# EAGLE schematic Slutsteg (EAGLE 9.6.2)

## Sheet 1 of 6: Connectors
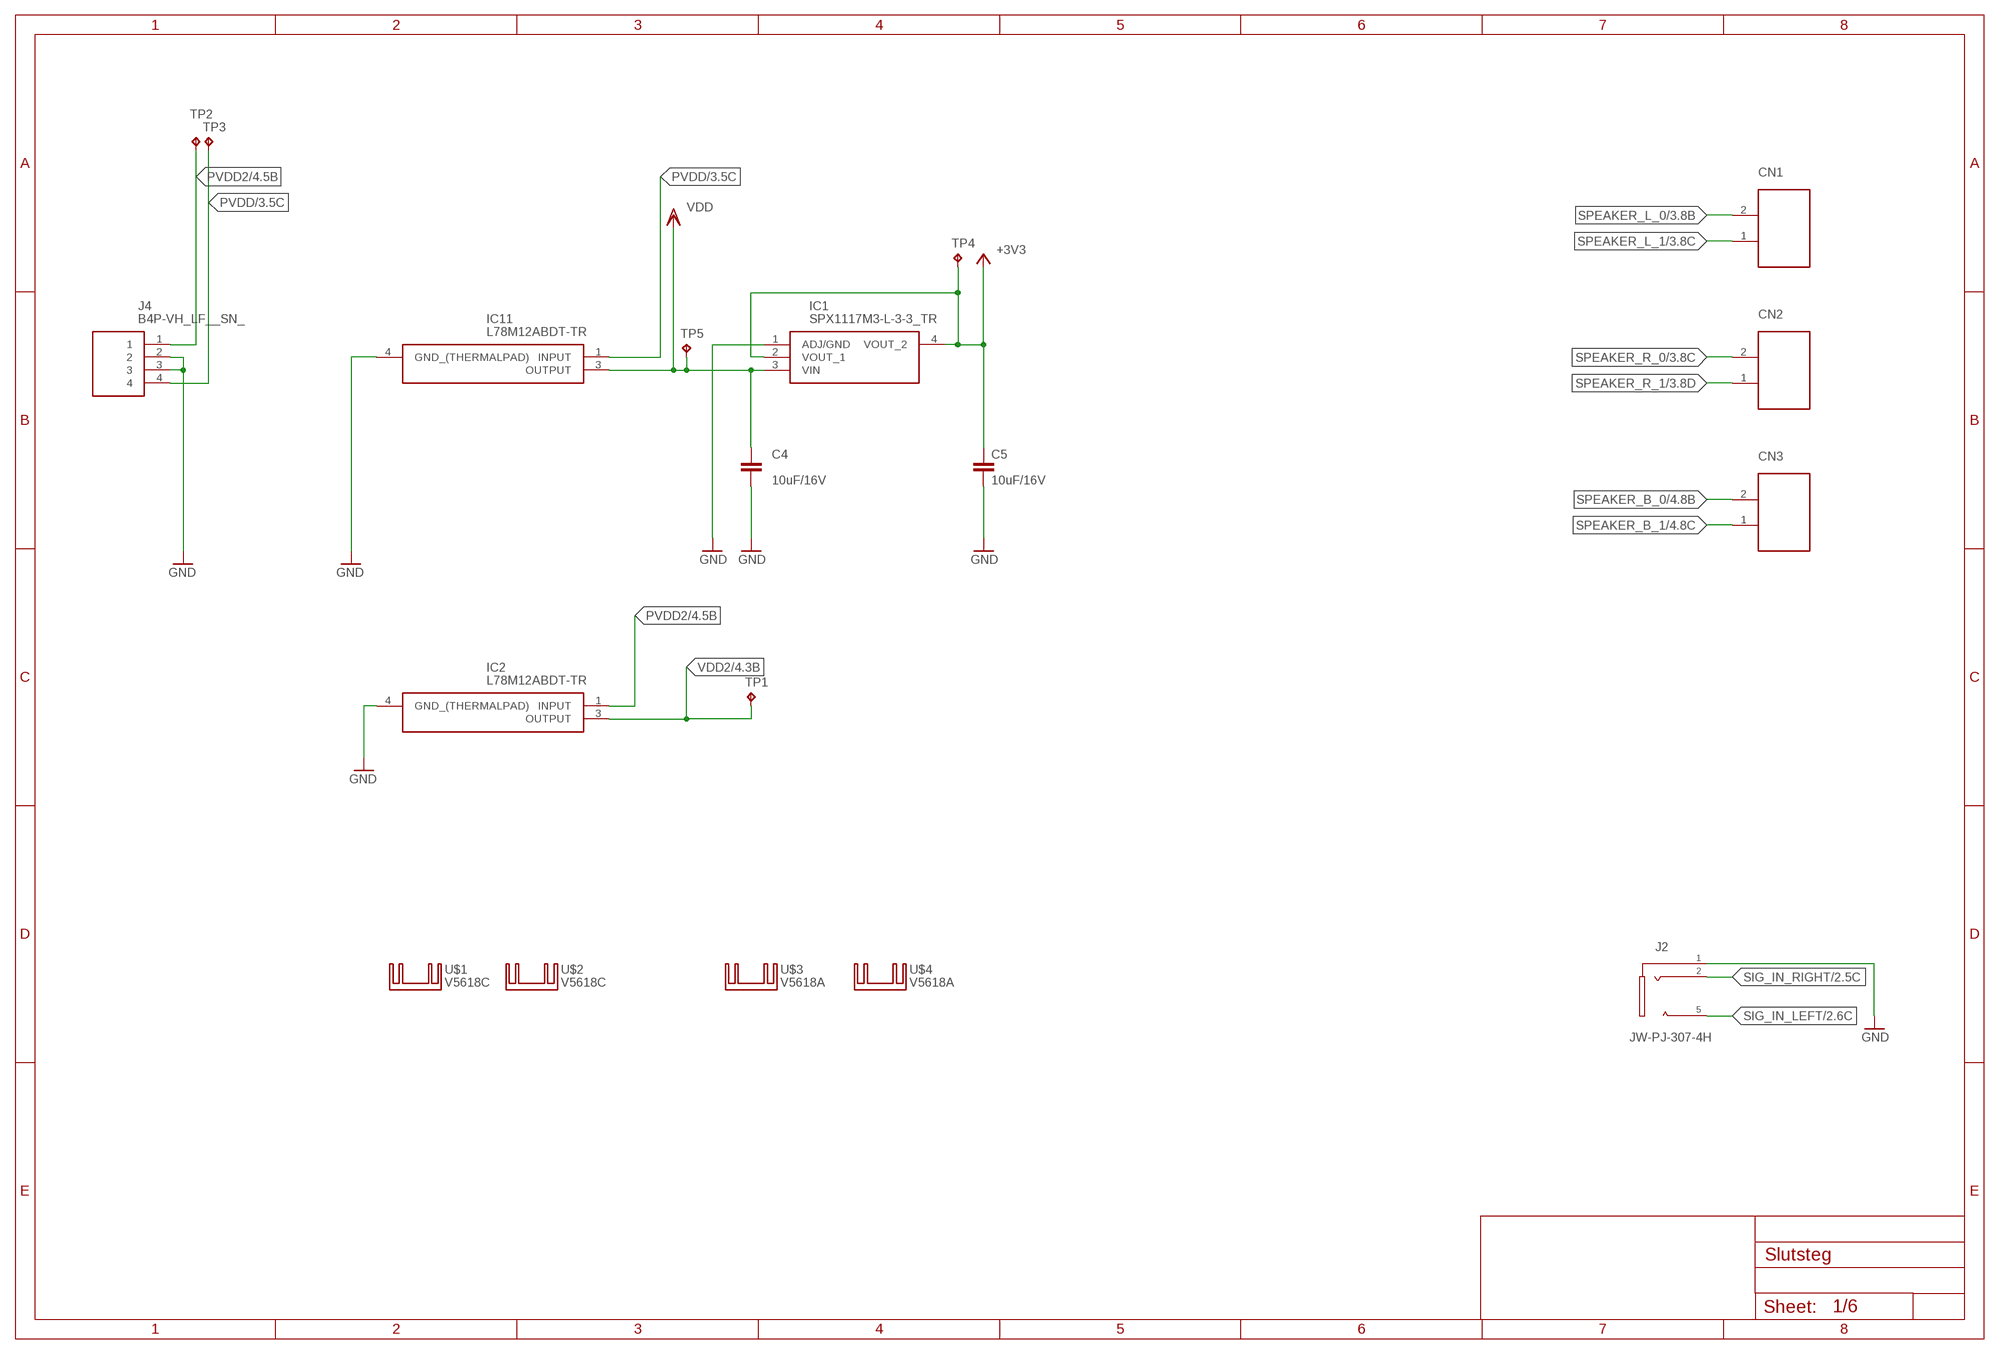
[diagram p0: schematic, sheet 1]

### Parts
C4  10uF/16V  C-EUC0805  [C0805]
C5  10uF/16V  C-EUC0805  [C0805]
CN1  OSTYK33102030-2  [OSTYK33108030-2]
CN2  OSTYK33102030-2  [OSTYK33108030-2]
CN3  OSTYK33102030-2  [OSTYK33108030-2]
IC1  SPX1117M3-L-3-3_TR  [SOT230P700X180-4N]
IC2  L78M12ABDT-TR  [TO228P972X240-3N]
IC11  L78M12ABDT-TR  [TO228P972X240-3N]
J2  JW-PJ-307-4H  [JW-PJ-307-4H]
J4  B4P-VH_LF__SN_  [SHDR4W114P0X396_1X4_1578X850X9]
TP1  TPB2,54  [B2,54]
TP2  TPB1,27  [B1,27]
TP3  TPB1,27  [B1,27]
TP4  TPB1,27  [B1,27]
TP5  TPB1,27  [B1,27]
U$1  V5618C  [V5618C]
U$2  V5618C  [V5618C]
U$3  V5618A  [V5618A]
U$4  V5618A  [V5618A]

### Nets
+3V3: C5.1 IC1.2(VOUT_1) IC1.4(VOUT_2) TP4.TP ; also sheet 2,3
GND: C4.2 C5.2 IC1.1(ADJ/GND) IC2.4(GND_(THERMALPAD)) IC11.4(GND_(THERMALPAD)) J2.1 J4.2 J4.3 ; also sheet 2,3,4,5,6
PVDD: IC11.1(INPUT) J4.4 TP3.TP ; also sheet 3
PVDD2: IC2.1(INPUT) J4.1 TP2.TP ; also sheet 4
SIG_IN_LEFT: J2.5 ; also sheet 2,5
SIG_IN_RIGHT: J2.2 ; also sheet 2,5
SPEAKER_B_0: CN3.2 ; also sheet 4
SPEAKER_B_1: CN3.1 ; also sheet 4
SPEAKER_L_0: CN1.2 ; also sheet 3
SPEAKER_L_1: CN1.1 ; also sheet 3
SPEAKER_R_0: CN2.2 ; also sheet 3
SPEAKER_R_1: CN2.1 ; also sheet 3
VDD: C4.1 IC1.3(VIN) IC11.3(OUTPUT) TP5.TP ; also sheet 2,3,5,6
VDD2: IC2.3(OUTPUT) TP1.TP ; also sheet 4

## Sheet 2 of 6
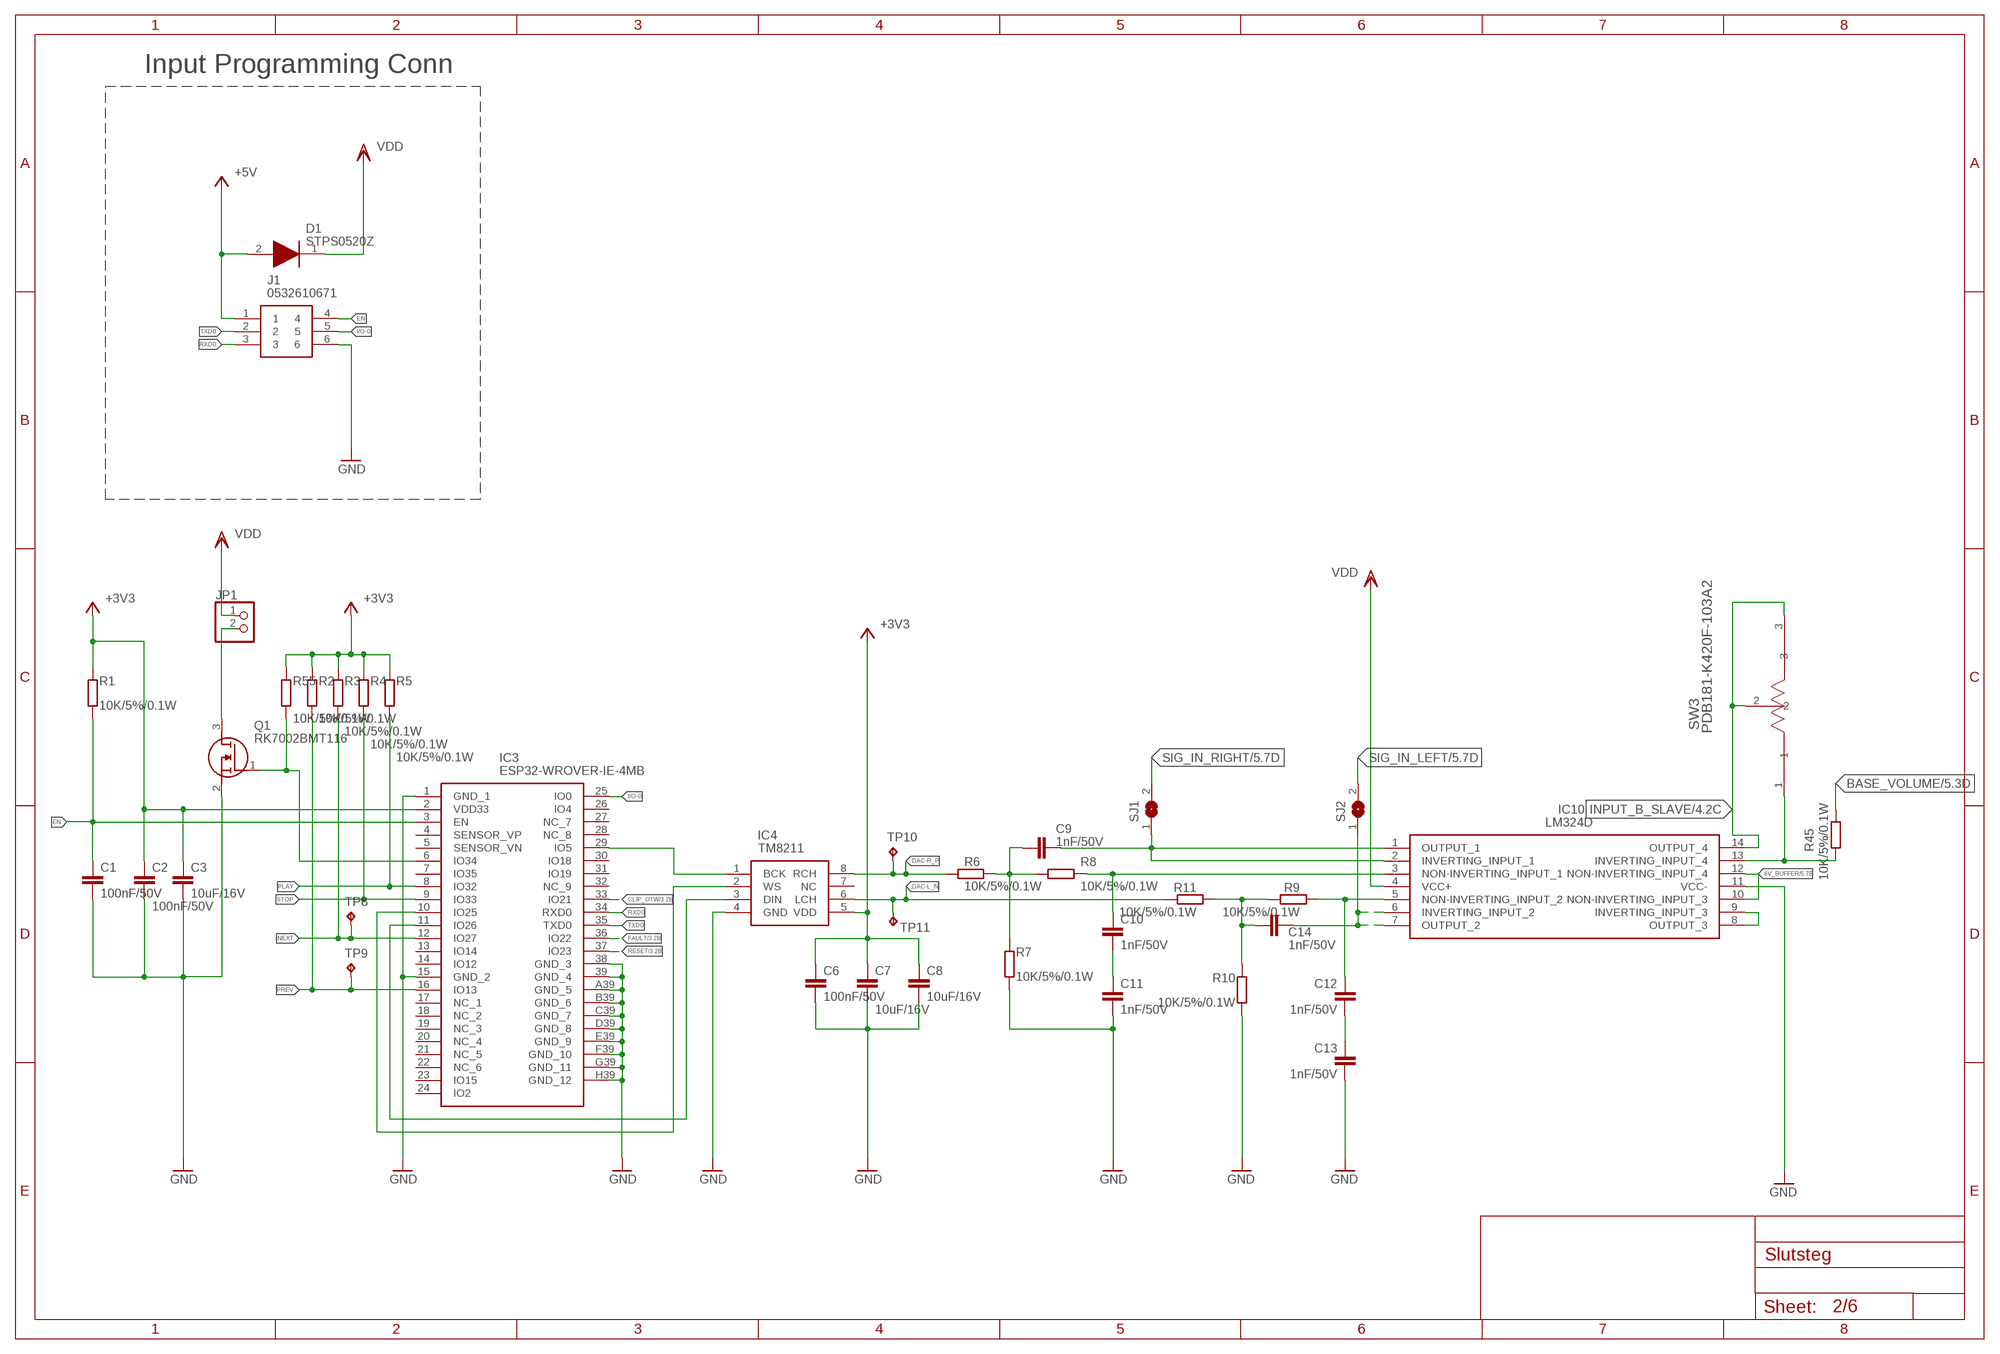
[diagram p1: schematic, sheet 2]

### Parts
C1  100nF/50V  C-EUC0603  [C0603]
C2  100nF/50V  C-EUC0603  [C0603]
C3  10uF/16V  C-EUC0805  [C0805]
C6  100nF/50V  C-EUC0603  [C0603]
C7  10uF/16V  C-EUC0805  [C0805]
C8  10uF/16V  C-EUC0805  [C0805]
C9  1nF/50V  C-EUC0603  [C0603]
C10  1nF/50V  C-EUC0603  [C0603]
C11  1nF/50V  C-EUC0603  [C0603]
C12  1nF/50V  C-EUC0603  [C0603]
C13  1nF/50V  C-EUC0603  [C0603]
C14  1nF/50V  C-EUC0603  [C0603]
D1  STPS0520Z  [SOD3816X145N]
IC3  ESP32-WROVER-IE-4MB  ESP32-WROVER-IE__16MB_  [ESP32WROVERE8MB]
IC4  TM8211  [SOIC127P600X196-8N]
IC10  LM324D  [SOIC127P600X175-14N]
J1  0532610671  [0532610671]
JP1  PINHD-1X2  [1X02]
Q1  RK7002BMT116  [BSS64AHZGT116]
R1  10K/5%/0.1W  R-EU_R0603  [R0603]
R2  10K/5%/0.1W  R-EU_R0603  [R0603]
R3  10K/5%/0.1W  R-EU_R0603  [R0603]
R4  10K/5%/0.1W  R-EU_R0603  [R0603]
R5  10K/5%/0.1W  R-EU_R0603  [R0603]
R6  10K/5%/0.1W  R-EU_R0603  [R0603]
R7  10K/5%/0.1W  R-EU_R0603  [R0603]
R8  10K/5%/0.1W  R-EU_R0603  [R0603]
R9  10K/5%/0.1W  R-EU_R0603  [R0603]
R10  10K/5%/0.1W  R-EU_R0603  [R0603]
R11  10K/5%/0.1W  R-EU_R0603  [R0603]
R45  10K/5%/0.1W  R-EU_R0603  [R0603]
R55  10K/5%/0.1W  R-EU_R0603  [R0603]
SJ1  SJ  [SJ]
SJ2  SJ  [SJ]
SW3  PDB181-K420F-103A2  [SW_420F-103A2_BRN]
TP8  TPB1,27  [B1,27]
TP9  TPB1,27  [B1,27]
TP10  TPB1,27  [B1,27]
TP11  TPB1,27  [B1,27]

### Nets
6V_BUFFER: IC10.10(NON-INVERTING_INPUT_3) IC10.12(NON-INVERTING_INPUT_4) ; also sheet 5
+3V3: C2.1 C3.1 C6.1 C7.1 C8.1 IC3.2(VDD33) IC4.5(VDD) R1.1 R2.1 R3.1 R4.1 R5.1 R55.1 ; also sheet 1,3
+5V: D1.2(A) J1.1
BASE_VOLUME: R45.1 ; also sheet 5
CLIP_OTW: IC3.33(IO21) ; also sheet 3,4
DAC-L_N [DAC-Diff]: IC4.6(LCH) R11.1 TP11.TP
DAC-R_P [DAC-Diff]: IC4.8(RCH) R6.2 TP10.TP
EN: C1.1 IC3.3(EN) J1.4 R1.2
FAULT: IC3.36(IO22) ; also sheet 3,4
GND: C1.2 C2.2 C3.2 C6.2 C7.2 C8.2 C11.2 C13.2 IC3.1(GND_1) IC3.15(GND_2) IC3.38(GND_3) IC3.39(GND_4) IC3.A39(GND_5) IC3.B39(GND_6) IC3.C39(GND_7) IC3.D39(GND_8) IC3.E39(GND_9) IC3.F39(GND_10) IC3.G39(GND_11) IC3.H39(GND_12) IC4.4(GND) IC10.11(VCC-) J1.6 Q1.2(S) R7.2 R10.2 ; also sheet 1,3,4,5,6
GSDJT: C9.1 IC10.1(OUTPUT_1) IC10.2(INVERTING_INPUT_1) SJ1.1
I/O-0: IC3.25(IO0) J1.5
INPUT_B_SLAVE: IC10.14(OUTPUT_4) SW3.2 SW3.3 ; also sheet 4,6
N$4: IC10.13(INVERTING_INPUT_4) R45.2 SW3.1
N$5: IC10.8(OUTPUT_3) IC10.9(INVERTING_INPUT_3)
N$13: IC3.6(IO34) Q1.1(G) R55.2
N$14: JP1.2 Q1.3(D)
N$76: IC3.11(IO26) IC4.3(DIN)
N$77: IC3.29(IO5) IC4.1(BCK)
N$78: IC3.10(IO25) IC4.2(WS)
N$79: C10.1 IC10.3(NON-INVERTING_INPUT_1) R8.1
N$80: C10.2 C11.1
N$81: C12.1 IC10.5(NON-INVERTING_INPUT_2) R9.2
N$82: C12.2 C13.1
N$83: C14.2 R9.1 R10.1 R11.2
N$84: C9.2 R6.1 R7.1 R8.2
NEXT: IC3.12(IO27) R3.2 TP8.TP
PLAY: IC3.8(IO32) R5.2
PREV: IC3.16(IO13) R2.2 TP9.TP
RESET: IC3.37(IO23) ; also sheet 3,4
RXD0: IC3.34(RXD0) J1.3
SIG_IN_LEFT: SJ2.2 ; also sheet 1,5
SIG_IN_RIGHT: SJ1.2 ; also sheet 1,5
STOP: IC3.9(IO33) R4.2
TGHJESYRJK: C14.1 IC10.6(INVERTING_INPUT_2) IC10.7(OUTPUT_2) SJ2.1
TXD0: IC3.35(TXD0) J1.2
VDD: D1.1(K) IC10.4(VCC+) JP1.1 ; also sheet 1,3,5,6
Unconnected: IC3.4(SENSOR_VP) IC3.5(SENSOR_VN) IC3.7(IO35) IC3.13(IO14) IC3.14(IO12) IC3.17(NC_1) IC3.18(NC_2) IC3.19(NC_3) IC3.20(NC_4) IC3.21(NC_5) IC3.22(NC_6) IC3.23(IO15) IC3.24(IO2) IC3.26(IO4) IC3.27(NC_7) IC3.28(NC_8) IC3.30(IO18) IC3.31(IO19) IC3.32(NC_9) IC4.7(NC)

### Notes on the sheet
- Input Programming Conn

## Sheet 3 of 6: TPA3244
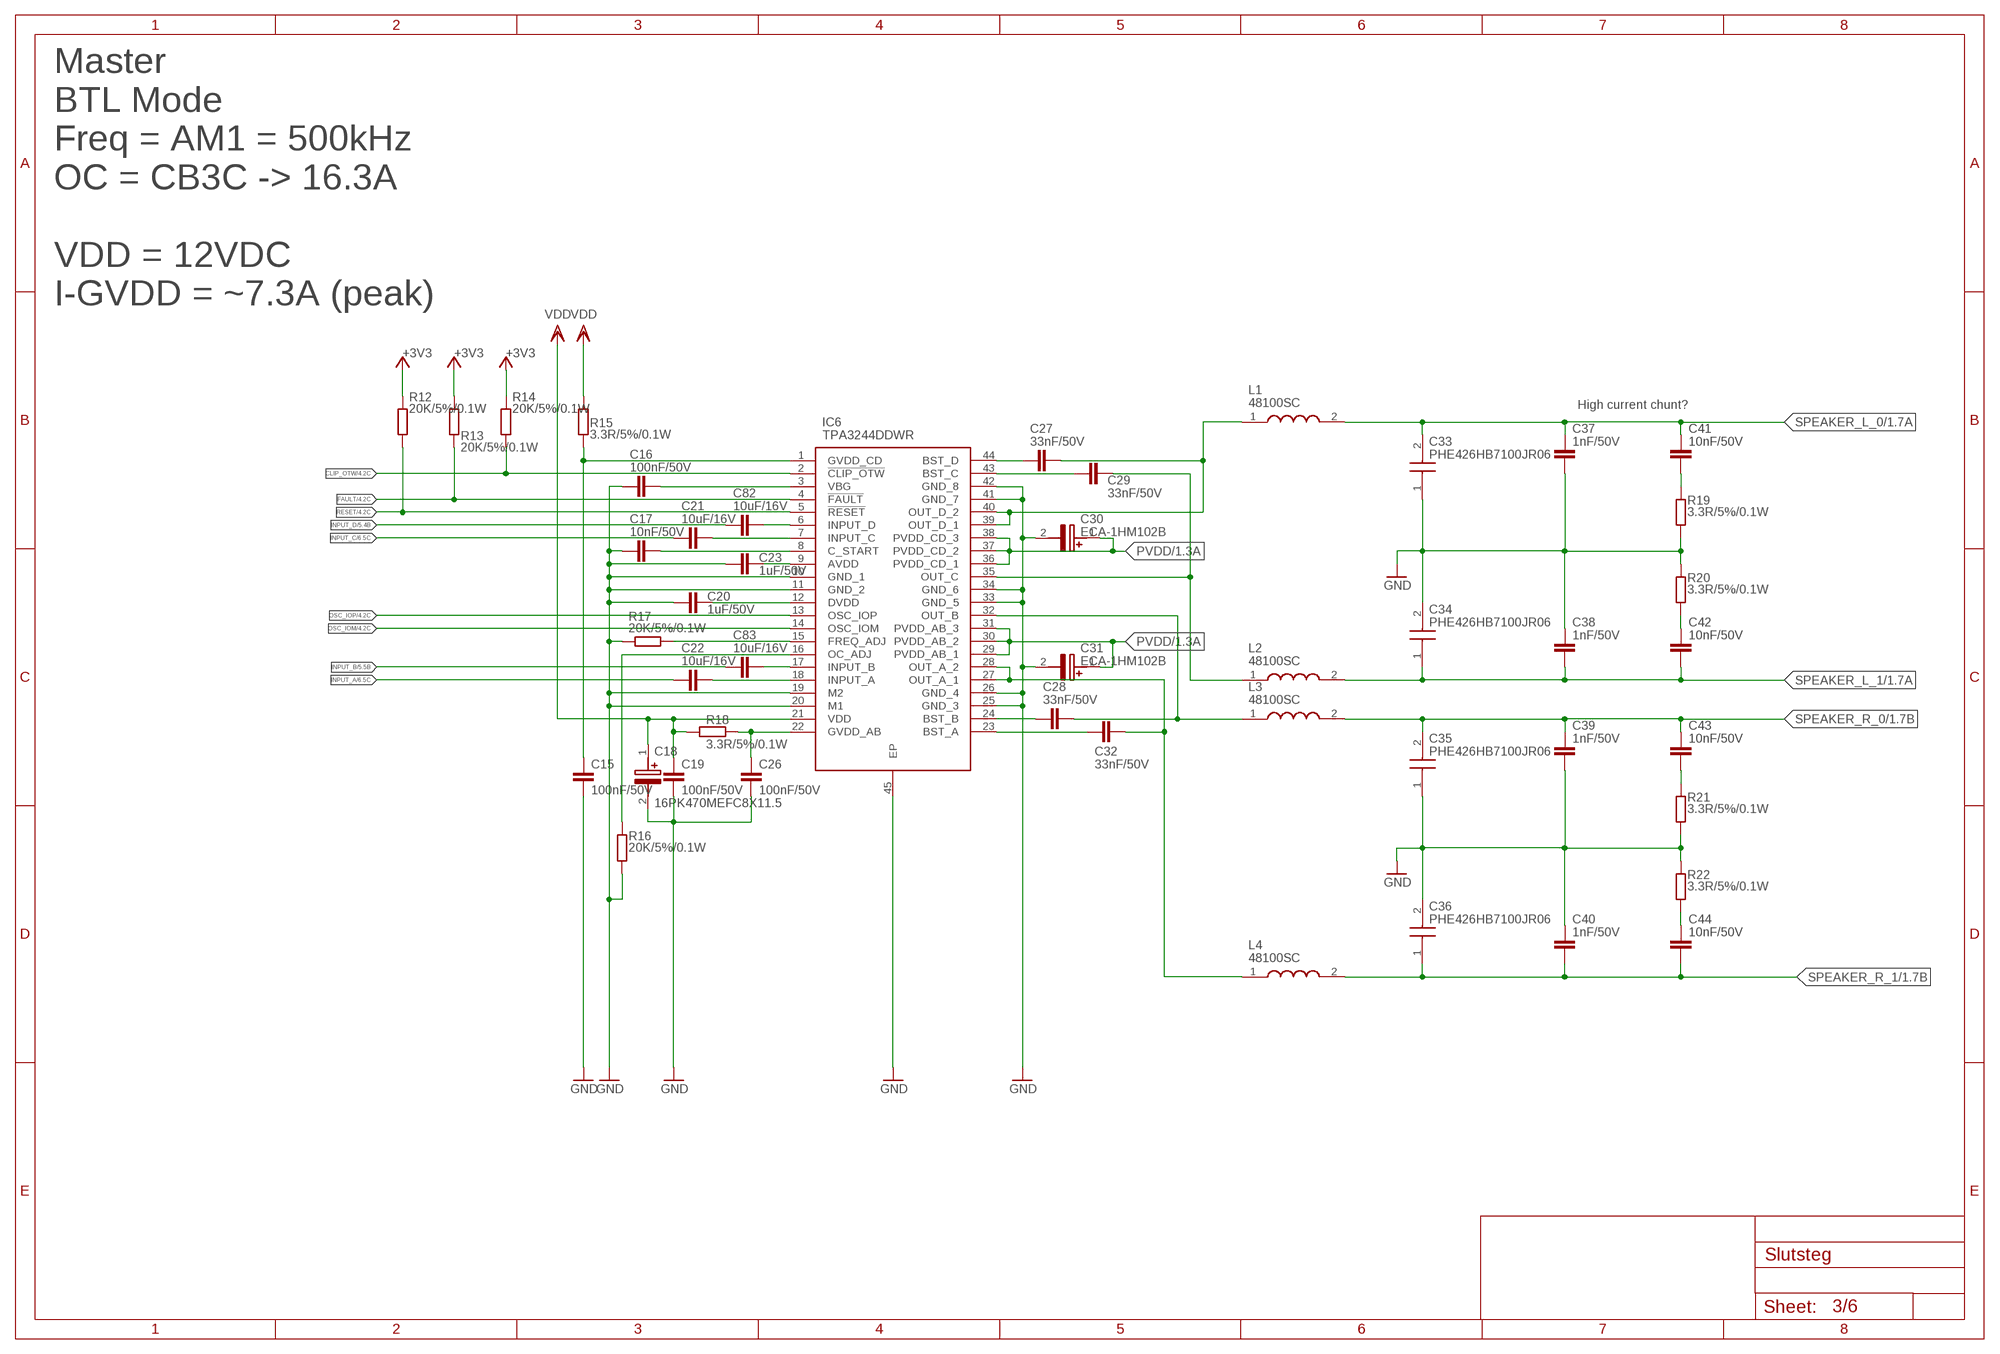
[diagram p2: schematic, sheet 3]

### Parts
C15  100nF/50V  C-EUC0603  [C0603]
C16  100nF/50V  C-EUC0603  [C0603]
C17  10nF/50V  C-EUC0603  [C0603]
C18  16PK470MEFC8X11.5  [CAPPRD350W60D825H1300]
C19  100nF/50V  C-EUC0603  [C0603]
C20  1uF/50V  C-EUC0805  [C0805]
C21  10uF/16V  C-EUC0805  [C0805]
C22  10uF/16V  C-EUC0805  [C0805]
C23  1uF/50V  C-EUC0805  [C0805]
C26  100nF/50V  C-EUC0603  [C0603]
C27  33nF/50V  C-EUC0603  [C0603]
C28  33nF/50V  C-EUC0603  [C0603]
C29  33nF/50V  C-EUC0603  [C0603]
C30  ECA-1HM102B  UVY1H102MHD  [CAPPRD500W60D1300H2650]
C31  ECA-1HM102B  UVY1H102MHD  [CAPPRD500W60D1300H2650]
C32  33nF/50V  C-EUC0603  [C0603]
C33  PHE426HB7100JR06  [PHE426HB7100JR06]
C34  PHE426HB7100JR06  [PHE426HB7100JR06]
C35  PHE426HB7100JR06  [PHE426HB7100JR06]
C36  PHE426HB7100JR06  [PHE426HB7100JR06]
C37  1nF/50V  C-EUC0603  [C0603]
C38  1nF/50V  C-EUC0603  [C0603]
C39  1nF/50V  C-EUC0603  [C0603]
C40  1nF/50V  C-EUC0603  [C0603]
C41  10nF/50V  C-EUC0603  [C0603]
C42  10nF/50V  C-EUC0603  [C0603]
C43  10nF/50V  C-EUC0603  [C0603]
C44  10nF/50V  C-EUC0603  [C0603]
C82  10uF/16V  C-EUC0805  [C0805]
C83  10uF/16V  C-EUC0805  [C0805]
IC6  TPA3244DDWR  [SOP64P810X120-45N]
L1  48100SC  [INDPM122122X600N]
L2  48100SC  [INDPM122122X600N]
L3  48100SC  [INDPM122122X600N]
L4  48100SC  [INDPM122122X600N]
R12  20K/5%/0.1W  R-EU_R0603  [R0603]
R13  20K/5%/0.1W  R-EU_R0603  [R0603]
R14  20K/5%/0.1W  R-EU_R0603  [R0603]
R15  3.3R/5%/0.1W  R-EU_R0603  [R0603]
R16  20K/5%/0.1W  R-EU_R0603  [R0603]
R17  20K/5%/0.1W  R-EU_R0603  [R0603]
R18  3.3R/5%/0.1W  R-EU_R0603  [R0603]
R19  3.3R/5%/0.1W  R-EU_R0603  [R0603]
R20  3.3R/5%/0.1W  R-EU_R0603  [R0603]
R21  3.3R/5%/0.1W  R-EU_R0603  [R0603]
R22  3.3R/5%/0.1W  R-EU_R0603  [R0603]

### Nets
+3V3: R12.2 R13.2 R14.2 ; also sheet 1,2
CLIP_OTW: IC6.2(!CLIP_OTW) R14.1 ; also sheet 2,4
FAULT: IC6.4(!FAULT) R13.1 ; also sheet 2,4
GND: C15.2 C16.2 C17.2 C18.2(-) C19.2 C20.1 C23.1 C26.2 C30.2(-) C31.2(-) C33.1 C34.2 C35.1 C36.2 C37.2 C38.1 C39.2 C40.1 IC6.10(GND_1) IC6.11(GND_2) IC6.19(M2) IC6.20(M1) IC6.25(GND_3) IC6.26(GND_4) IC6.33(GND_5) IC6.34(GND_6) IC6.41(GND_7) IC6.42(GND_8) IC6.45(EP) R16.1 R17.1 R19.1 R20.2 R21.1 R22.2 ; also sheet 1,2,4,5,6
INPUT_A: C22.1 ; also sheet 6
INPUT_B: C83.1 ; also sheet 5,6
INPUT_C: C21.1 ; also sheet 6
INPUT_D: C82.1 ; also sheet 5,6
N$1: C20.2 IC6.12(DVDD)
N$7: C82.2 IC6.6(INPUT_D)
N$10: C83.2 IC6.17(INPUT_B)
N$44: C27.1 IC6.44(BST_D)
N$45: C29.1 IC6.43(BST_C)
N$48: C41.2 R19.2
N$49: C42.1 R20.1
N$51: C28.1 IC6.24(BST_B)
N$52: C32.1 IC6.23(BST_A)
N$53: C43.2 R21.2
N$54: C44.1 R22.1
N$55: IC6.15(FREQ_ADJ) R17.2
N$56: C16.1 IC6.3(VBG)
N$57: C17.1 IC6.8(C_START)
N$58: C23.2 IC6.9(AVDD)
N$59: C15.1 IC6.1(GVDD_CD) R15.1
N$60: C26.1 IC6.22(GVDD_AB) R18.1
N$62: C21.2 IC6.7(INPUT_C)
N$64: C22.2 IC6.18(INPUT_A)
N$65: IC6.16(OC_ADJ) R16.2
OSC_IOM: IC6.14(OSC_IOM) ; also sheet 4
OSC_IOP: IC6.13(OSC_IOP) ; also sheet 4
OUT_A: C32.2 IC6.27(OUT_A_1) IC6.28(OUT_A_2) L4.1
OUT_B: C28.2 IC6.32(OUT_B) L3.1
OUT_C: C29.2 IC6.35(OUT_C) L2.1
OUT_D: C27.2 IC6.39(OUT_D_1) IC6.40(OUT_D_2) L1.1
PVDD: C30.1(+) C31.1(+) IC6.29(PVDD_AB_1) IC6.30(PVDD_AB_2) IC6.31(PVDD_AB_3) IC6.36(PVDD_CD_1) IC6.37(PVDD_CD_2) IC6.38(PVDD_CD_3) ; also sheet 1
RESET: IC6.5(!RESET) R12.1 ; also sheet 2,4
SPEAKER_L_0: C33.2 C37.1 C41.1 L1.2 ; also sheet 1
SPEAKER_L_1: C34.1 C38.2 C42.2 L2.2 ; also sheet 1
SPEAKER_R_0: C35.2 C39.1 C43.1 L3.2 ; also sheet 1
SPEAKER_R_1: C36.1 C40.2 C44.2 L4.2 ; also sheet 1
VDD: C18.1(+) C19.1 IC6.21(VDD) R15.2 R18.2 ; also sheet 1,2,5,6

### Notes on the sheet
- Master
  BTL Mode
  Freq = AM1 = 500kHz
  OC = CB3C -> 16.3A
  
  VDD = 12VDC
  I-GVDD = ~7.3A (peak)
- High current chunt?

## Sheet 4 of 6: TPA3251
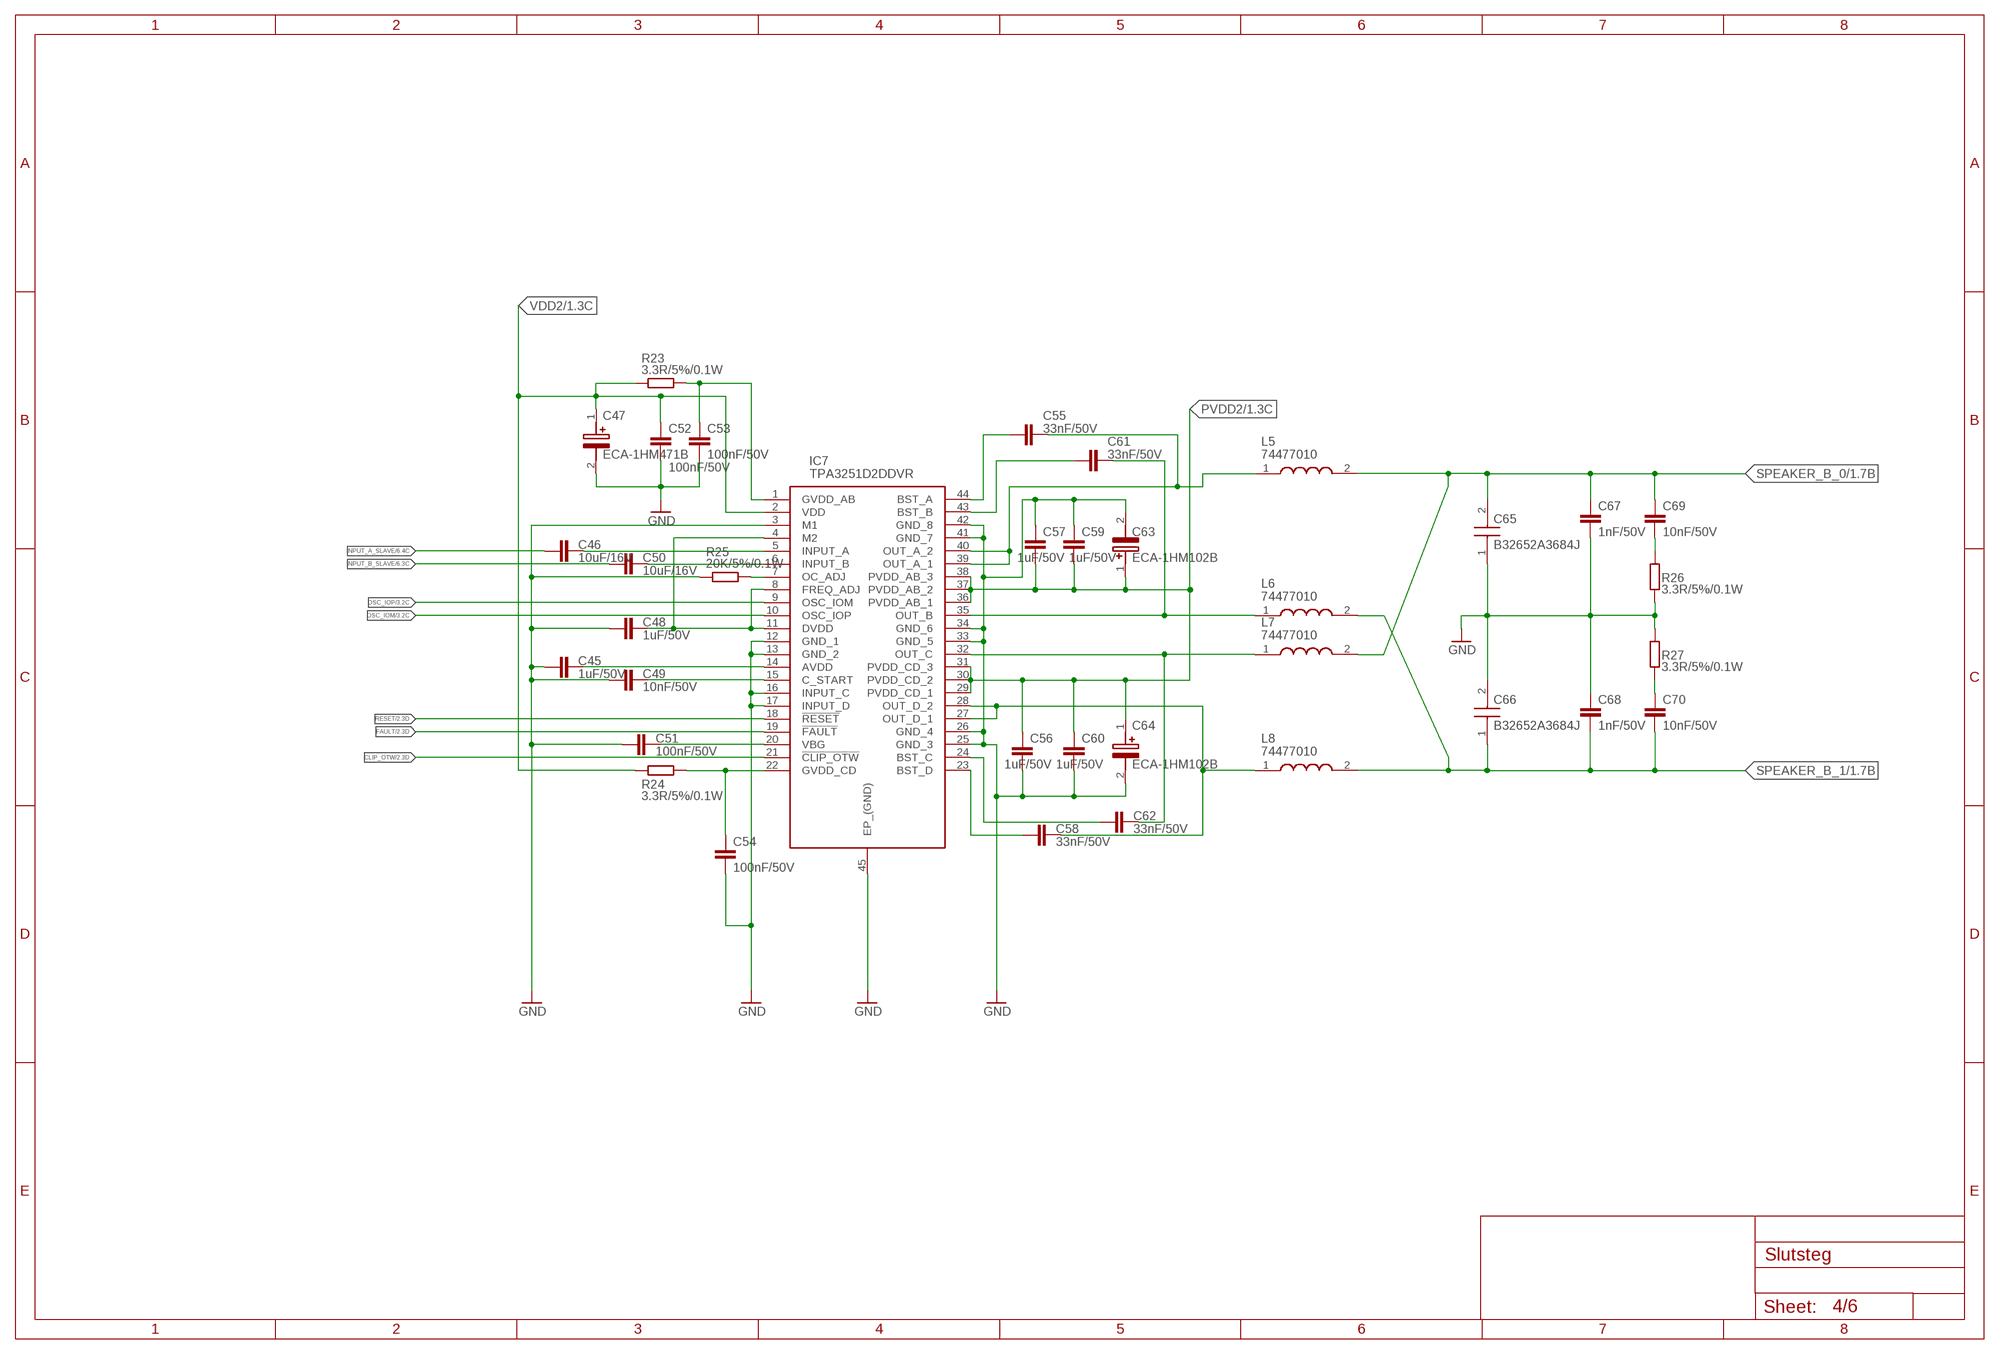
[diagram p3: schematic, sheet 4]

### Parts
C45  1uF/50V  C-EUC0805  [C0805]
C46  10uF/16V  C-EUC0805  [C0805]
C47  ECA-1HM471B  16PK470MEFC8X11.5  [CAPPRD350W60D825H1300]
C48  1uF/50V  C-EUC0805  [C0805]
C49  10nF/50V  C-EUC0603  [C0603]
C50  10uF/16V  C-EUC0805  [C0805]
C51  100nF/50V  C-EUC0603  [C0603]
C52  100nF/50V  C-EUC0603  [C0603]
C53  100nF/50V  C-EUC0603  [C0603]
C54  100nF/50V  C-EUC0603  [C0603]
C55  33nF/50V  C-EUC0603  [C0603]
C56  1uF/50V  C-EUC0805  [C0805]
C57  1uF/50V  C-EUC0805  [C0805]
C58  33nF/50V  C-EUC0603  [C0603]
C59  1uF/50V  C-EUC0805  [C0805]
C60  1uF/50V  C-EUC0805  [C0805]
C61  33nF/50V  C-EUC0603  [C0603]
C62  33nF/50V  C-EUC0603  [C0603]
C63  ECA-1HM102B  UVY1H102MHD  [CAPPRD500W60D1300H2650]
C64  ECA-1HM102B  UVY1H102MHD  [CAPPRD500W60D1300H2650]
C65  B32652A3684J  [B32652A3684J]
C66  B32652A3684J  [B32652A3684J]
C67  1nF/50V  C-EUC0603  [C0603]
C68  1nF/50V  C-EUC0603  [C0603]
C69  10nF/50V  C-EUC0603  [C0603]
C70  10nF/50V  C-EUC0603  [C0603]
IC7  TPA3251D2DDVR  [SOP64P810X120-45N@1]
L5  74477010  [WE-PD_1260/1245/1280/121054]
L6  74477010  [WE-PD_1260/1245/1280/121054]
L7  74477010  [WE-PD_1260/1245/1280/121054]
L8  74477010  [WE-PD_1260/1245/1280/121054]
R23  3.3R/5%/0.1W  R-EU_R0603  [R0603]
R24  3.3R/5%/0.1W  R-EU_R0603  [R0603]
R25  20K/5%/0.1W  R-EU_R0603  [R0603]
R26  3.3R/5%/0.1W  R-EU_R0603  [R0603]
R27  3.3R/5%/0.1W  R-EU_R0603  [R0603]

### Nets
CLIP_OTW: IC7.21(!CLIP_OTW) ; also sheet 2,3
FAULT: IC7.19(!FAULT) ; also sheet 2,3
GND: C45.1 C47.2(-) C48.1 C49.1 C51.1 C52.2 C53.2 C54.2 C56.2 C57.1 C59.1 C60.2 C63.2(-) C64.2(-) C65.1 C66.2 C67.2 C68.1 IC7.3(M1) IC7.12(GND_1) IC7.13(GND_2) IC7.16(INPUT_C) IC7.17(INPUT_D) IC7.25(GND_3) IC7.26(GND_4) IC7.33(GND_5) IC7.34(GND_6) IC7.41(GND_7) IC7.42(GND_8) IC7.45(EP_(GND)) R25.1 R26.1 R27.2 ; also sheet 1,2,3,5,6
INPUT_A_SLAVE: C46.2 ; also sheet 6
INPUT_B_SLAVE: C50.2 ; also sheet 2,6
N$2: C70.1 R27.1
N$3: C55.1 IC7.44(BST_A)
N$18: C55.2 IC7.39(OUT_A_1) IC7.40(OUT_A_2) L5.1
N$19: C61.2 IC7.35(OUT_B) L6.1
N$20: C58.1 IC7.23(BST_D)
N$25: C62.1 IC7.24(BST_C)
N$26: C62.2 IC7.32(OUT_C) L7.1
N$27: C46.1 IC7.5(INPUT_A)
N$28: C50.1 IC7.6(INPUT_B)
N$29: C53.1 IC7.1(GVDD_AB) R23.2
N$30: C51.2 IC7.20(VBG)
N$31: C49.2 IC7.15(C_START)
N$32: C45.2 IC7.14(AVDD)
N$33: C48.2 IC7.4(M2) IC7.8(FREQ_ADJ) IC7.11(DVDD)
N$34: IC7.7(OC_ADJ) R25.2
N$35: C61.1 IC7.43(BST_B)
N$36: C58.2 IC7.27(OUT_D_1) IC7.28(OUT_D_2) L8.1
N$37: C54.1 IC7.22(GVDD_CD) R24.2
N$38: C69.2 R26.2
OSC_IOM: IC7.10(OSC_IOP) ; also sheet 3
OSC_IOP: IC7.9(OSC_IOM) ; also sheet 3
PVDD2: C56.1 C57.2 C59.2 C60.1 C63.1(+) C64.1(+) IC7.29(PVDD_CD_1) IC7.30(PVDD_CD_2) IC7.31(PVDD_CD_3) IC7.36(PVDD_AB_1) IC7.37(PVDD_AB_2) IC7.38(PVDD_AB_3) ; also sheet 1
RESET: IC7.18(!RESET) ; also sheet 2,3
SPEAKER_B_0: C65.2 C67.1 C69.1 L5.2 L7.2 ; also sheet 1
SPEAKER_B_1: C66.1 C68.2 C70.2 L6.2 L8.2 ; also sheet 1
VDD2: C47.1(+) C52.1 IC7.2(VDD) R23.1 R24.1 ; also sheet 1

## Sheet 5 of 6: Delningsfilter
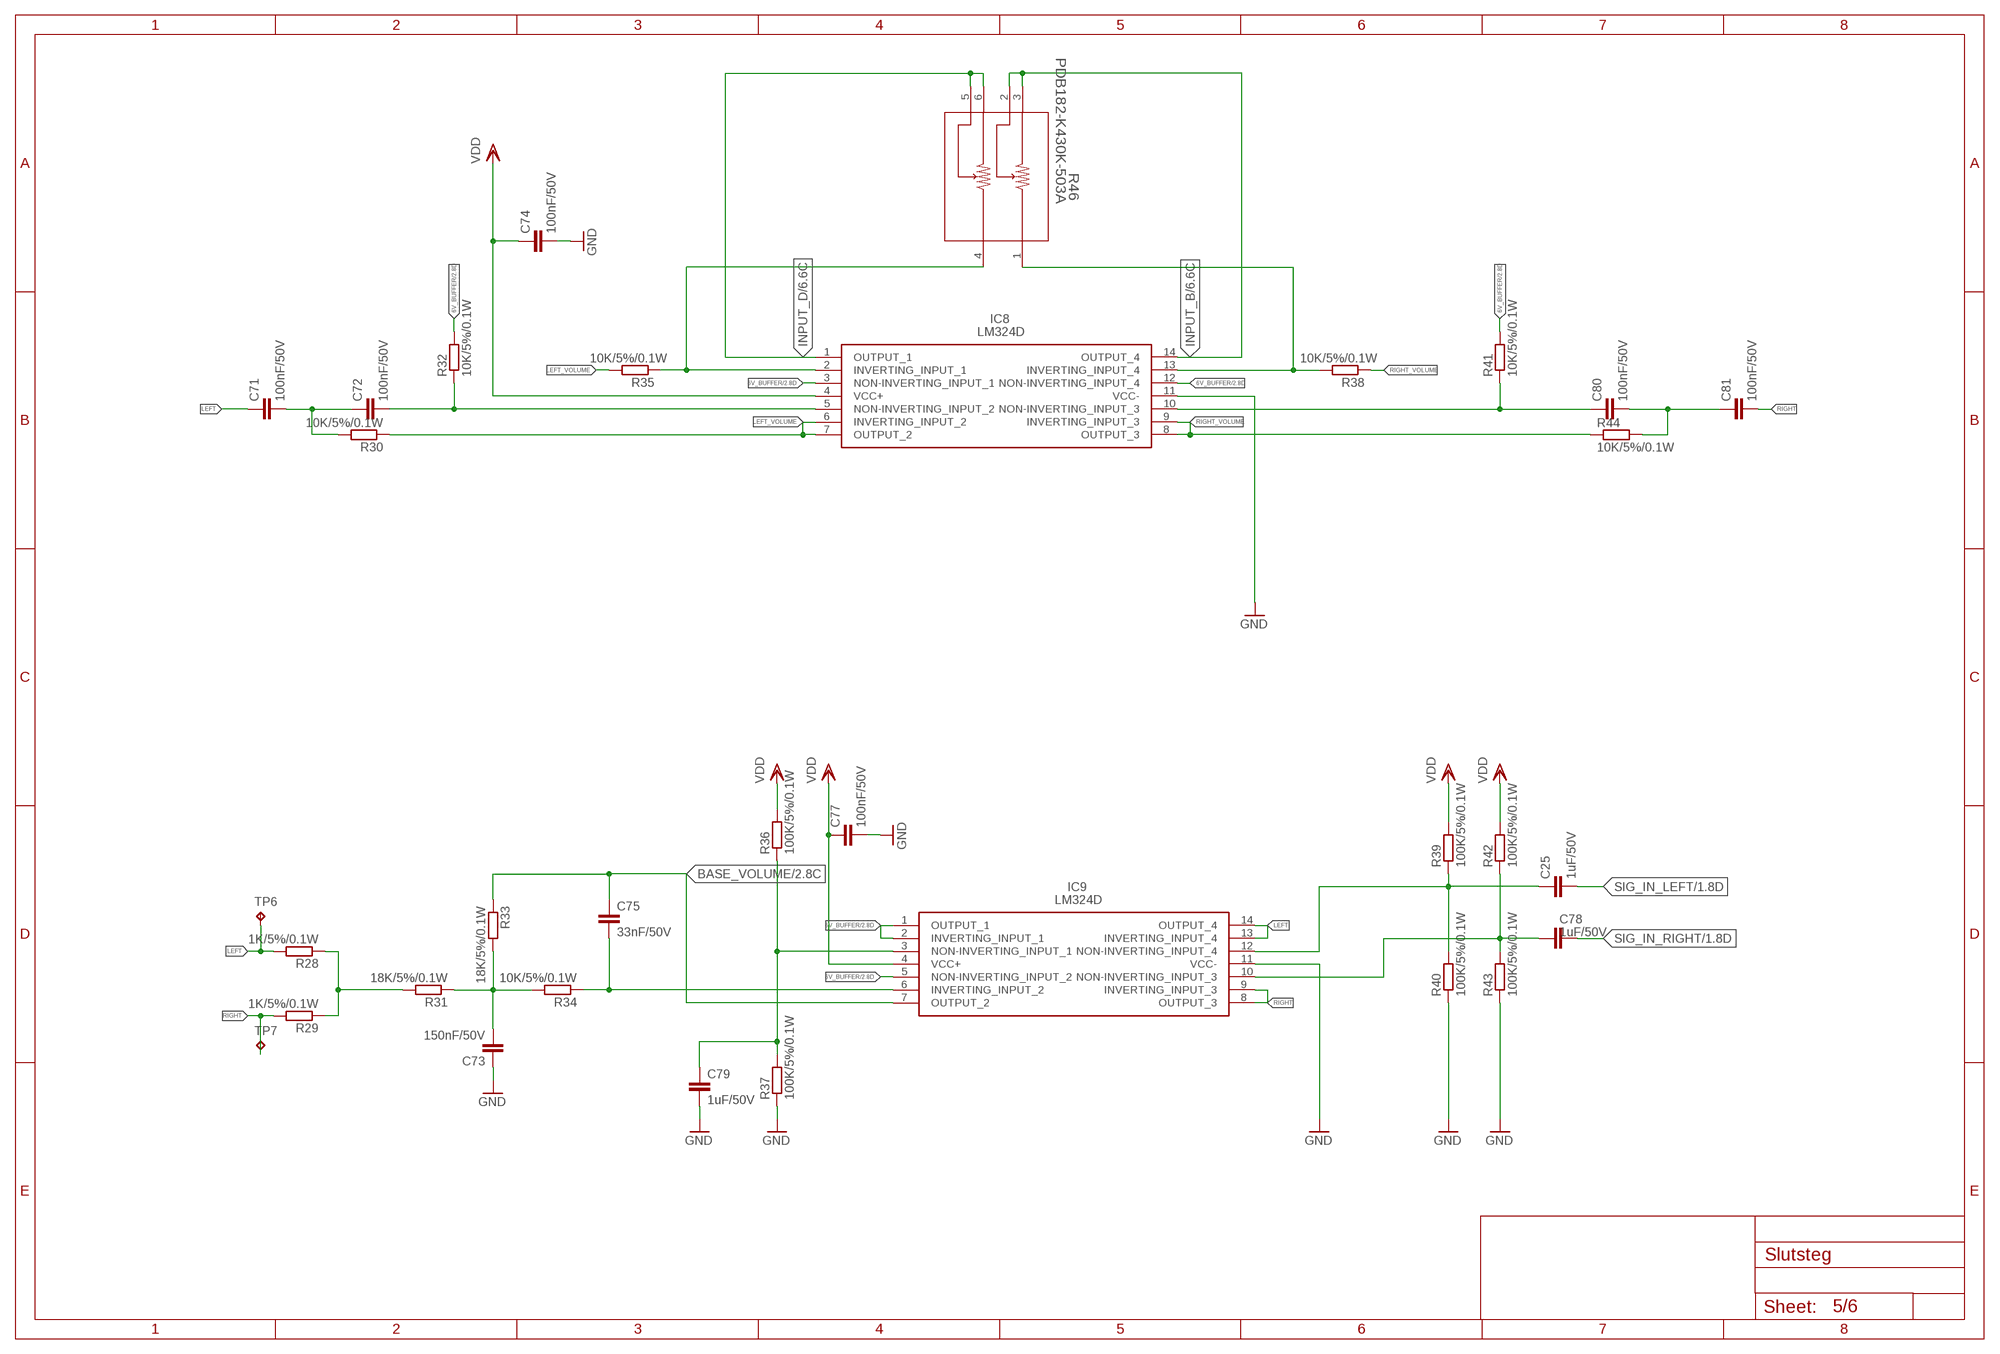
[diagram p4: schematic, sheet 5]

### Parts
C25  1uF/50V  C-EUC0805  [C0805]
C71  100nF/50V  C-EUC0603  [C0603]
C72  100nF/50V  C-EUC0603  [C0603]
C73  150nF/50V  C-EUC0603  [C0603]
C74  100nF/50V  C-EUC0603  [C0603]
C75  33nF/50V  C-EUC0603  [C0603]
C77  100nF/50V  C-EUC0603  [C0603]
C78  1uF/50V  C-EUC0805  [C0805]
C79  1uF/50V  C-EUC0805  [C0805]
C80  100nF/50V  C-EUC0603  [C0603]
C81  100nF/50V  C-EUC0603  [C0603]
IC8  LM324D  [SOIC127P600X175-14N]
IC9  LM324D  [SOIC127P600X175-14N]
R28  1K/5%/0.1W  R-EU_R0603  [R0603]
R29  1K/5%/0.1W  R-EU_R0603  [R0603]
R30  10K/5%/0.1W  R-EU_R0603  [R0603]
R31  18K/5%/0.1W  R-EU_R0603  [R0603]
R32  10K/5%/0.1W  R-EU_R0603  [R0603]
R33  18K/5%/0.1W  R-EU_R0603  [R0603]
R34  10K/5%/0.1W  R-EU_R0603  [R0603]
R35  10K/5%/0.1W  R-EU_R0603  [R0603]
R36  100K/5%/0.1W  R-EU_R0603  [R0603]
R37  100K/5%/0.1W  R-EU_R0603  [R0603]
R38  10K/5%/0.1W  R-EU_R0603  [R0603]
R39  100K/5%/0.1W  R-EU_R0603  [R0603]
R40  100K/5%/0.1W  R-EU_R0603  [R0603]
R41  10K/5%/0.1W  R-EU_R0603  [R0603]
R42  100K/5%/0.1W  R-EU_R0603  [R0603]
R43  100K/5%/0.1W  R-EU_R0603  [R0603]
R44  10K/5%/0.1W  R-EU_R0603  [R0603]
R46  PDB182-K430K-503A  [PDB18-2]
TP6  TPB1,27  [B1,27]
TP7  TPB1,27  [B1,27]

### Nets
6V_BUFFER: IC8.3(NON-INVERTING_INPUT_1) IC8.12(NON-INVERTING_INPUT_4) IC9.1(OUTPUT_1) IC9.2(INVERTING_INPUT_1) IC9.5(NON-INVERTING_INPUT_2) R32.2 R41.2 ; also sheet 2
BASE_VOLUME: C75.1 IC9.7(OUTPUT_2) R33.1 ; also sheet 2
GND: C73.1 C74.2 C77.2 C79.2 IC8.11(VCC-) IC9.11(VCC-) R37.1 R40.1 R43.1 ; also sheet 1,2,3,4,6
INPUT_B: IC8.14(OUTPUT_4) R46.2 R46.3 ; also sheet 3,6
INPUT_D: IC8.1(OUTPUT_1) R46.5 R46.6 ; also sheet 3,6
LEFT: C71.1 IC9.13(INVERTING_INPUT_4) IC9.14(OUTPUT_4) R28.2 TP6.TP
LEFT_VOLUME: IC8.6(INVERTING_INPUT_2) IC8.7(OUTPUT_2) R30.1 R35.2
N$46: C25.1 IC9.12(NON-INVERTING_INPUT_4) R39.1 R40.2
N$47: C78.1 IC9.10(NON-INVERTING_INPUT_3) R42.1 R43.2
N$50: C79.1 IC9.3(NON-INVERTING_INPUT_1) R36.1 R37.2
N$66: R28.1 R29.1 R31.2
N$67: C73.2 R31.1 R33.2 R34.2
N$68: C75.2 IC9.6(INVERTING_INPUT_2) R34.1
N$69: C71.2 C72.1 R30.2
N$70: C72.2 IC8.5(NON-INVERTING_INPUT_2) R32.1
N$71: IC8.2(INVERTING_INPUT_1) R35.1 R46.4
N$72: C80.1 IC8.10(NON-INVERTING_INPUT_3) R41.1
N$73: C80.2 C81.1 R44.2
N$74: IC8.13(INVERTING_INPUT_4) R38.2 R46.1
RIGHT: C81.2 IC9.8(OUTPUT_3) IC9.9(INVERTING_INPUT_3) R29.2 TP7.TP
RIGHT_VOLUME: IC8.8(OUTPUT_3) IC8.9(INVERTING_INPUT_3) R38.1 R44.1
SIG_IN_LEFT: C25.2 ; also sheet 1,2
SIG_IN_RIGHT: C78.2 ; also sheet 1,2
VDD: C74.1 C77.1 IC8.4(VCC+) IC9.4(VCC+) R36.2 R39.2 R42.2 ; also sheet 1,2,3,6

## Sheet 6 of 6: SE2DIFF
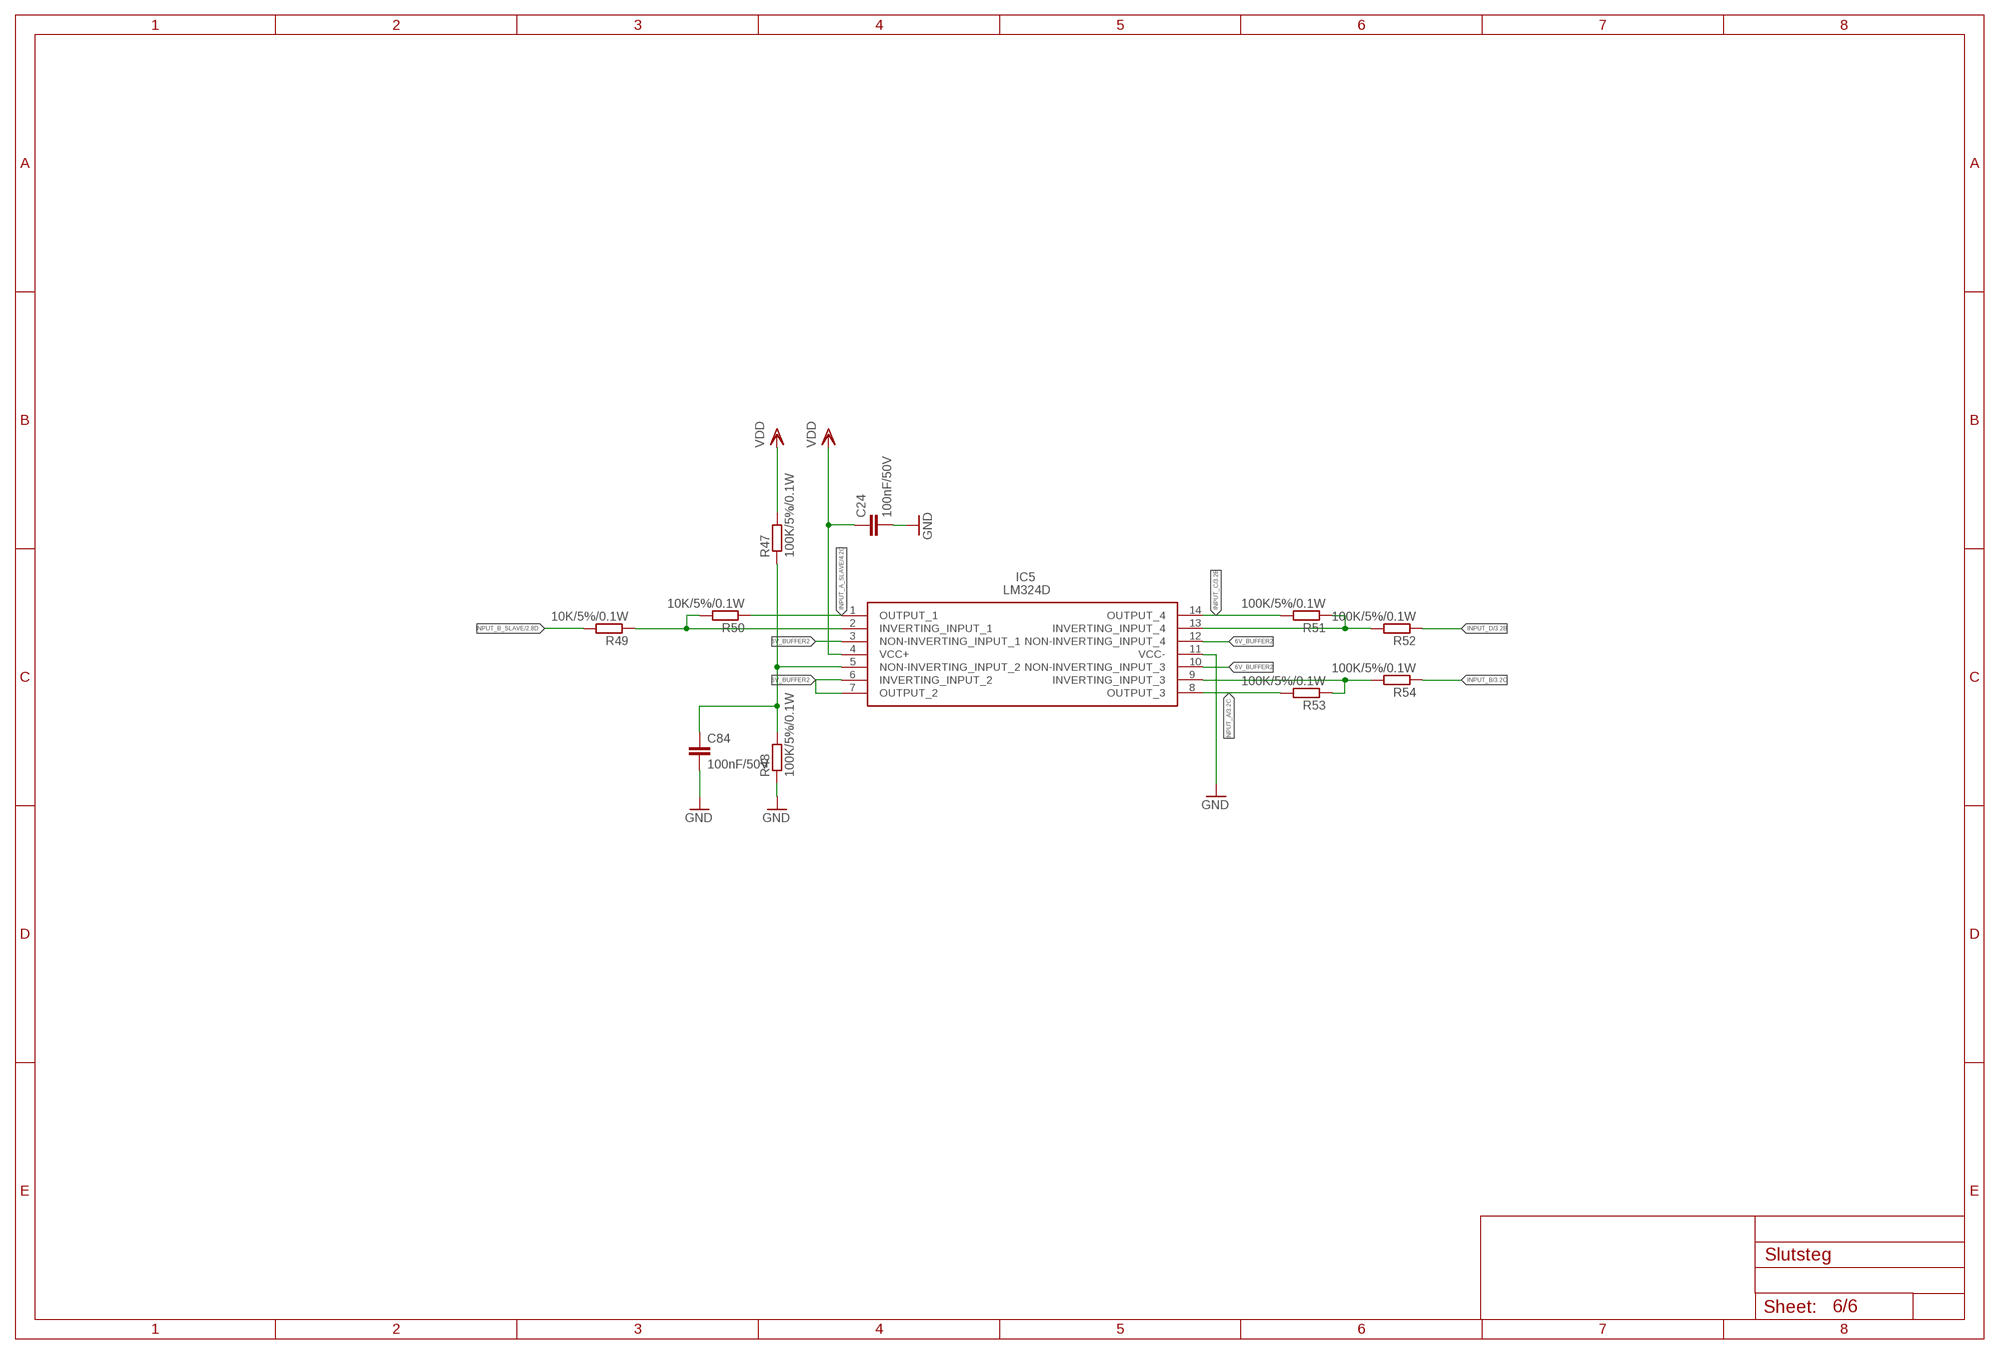
[diagram p5: schematic, sheet 6]

### Parts
C24  100nF/50V  C-EUC0603  [C0603]
C84  100nF/50V  C-EUC0603  [C0603]
IC5  LM324D  [SOIC127P600X175-14N]
R47  100K/5%/0.1W  R-EU_R0603  [R0603]
R48  100K/5%/0.1W  R-EU_R0603  [R0603]
R49  10K/5%/0.1W  R-EU_R0603  [R0603]
R50  10K/5%/0.1W  R-EU_R0603  [R0603]
R51  100K/5%/0.1W  R-EU_R0603  [R0603]
R52  100K/5%/0.1W  R-EU_R0603  [R0603]
R53  100K/5%/0.1W  R-EU_R0603  [R0603]
R54  100K/5%/0.1W  R-EU_R0603  [R0603]

### Nets
6V_BUFFER2: IC5.3(NON-INVERTING_INPUT_1) IC5.6(INVERTING_INPUT_2) IC5.7(OUTPUT_2) IC5.10(NON-INVERTING_INPUT_3) IC5.12(NON-INVERTING_INPUT_4)
GND: C24.2 C84.2 IC5.11(VCC-) R48.1 ; also sheet 1,2,3,4,5
INPUT_A: IC5.8(OUTPUT_3) R53.2 ; also sheet 3
INPUT_A_SLAVE: IC5.1(OUTPUT_1) R50.1 ; also sheet 4
INPUT_B: R54.1 ; also sheet 3,5
INPUT_B_SLAVE: R49.2 ; also sheet 2,4
INPUT_C: IC5.14(OUTPUT_4) R51.2 ; also sheet 3
INPUT_D: R52.1 ; also sheet 3,5
N$6: C84.1 IC5.5(NON-INVERTING_INPUT_2) R47.1 R48.2
N$8: IC5.13(INVERTING_INPUT_4) R51.1 R52.2
N$9: IC5.2(INVERTING_INPUT_1) R49.1 R50.2
N$12: IC5.9(INVERTING_INPUT_3) R53.1 R54.2
VDD: C24.1 IC5.4(VCC+) R47.2 ; also sheet 1,2,3,5

## Library data of the parts
C1-C17 C19-C29 C32 C37-C46 C48-C62 C67-C75 C77-C84 = rcl:C-EU: CAPACITOR, European symbol; SPICEPREFIX: C
C18 C47 = SamacSys_Parts:16PK470MEFC8X11.5: Rubycon 470uF 16 V dc Aluminium Electrolytic Capacitor, PK Series 2000h 8 Dia. x 11.5mm Source: Datasheet <https://rs.componentsearchengine.com/Datasheets/2/16PK470MEFC8X11.5.pdf>; ARROW_PART_NUMBER: 16PK470MEFC8X11.5; ARROW_PRICE-STOCK: https://www.arrow.com/en/products/16pk470mefc8x11.5/rubycon; DESCRIPTION: Rubycon 470uF 16 V dc Aluminium Electrolytic Capacitor, PK Series 2000h 8 Dia. x 11.5mm; HEIGHT: 13mm; MANUFACTURER_NAME: Rubycon; MANUFACTURER_PART_NUMBER: 16PK470MEFC8X11.5; MOUSER_PART_NUMBER: 232-16PK470MEFC8X115; MOUSER_PRICE-STOCK: https://www.mouser.com/Search/Refine.aspx?Keyword=232-16PK470MEFC8X115
C30 C31 C63 C64 = SamacSys_Parts:UVY1H102MHD: Al Cap Radial VY series 1000uF 50V Nichicon 1000uF 50 V Aluminium Electrolytic Capacitor, VY Series 1000h 12.5 Dia. x 25mm Source: Datasheet <https://componentsearchengine.com/Datasheets/1/UVY1H102MHD.pdf>; ARROW_PART_NUMBER: UVY1H102MHD; ARROW_PRICE-STOCK: https://www.arrow.com/en/products/uvy1h102mhd/nichicon; DESCRIPTION: Al Cap Radial VY series 1000uF 50V Nichicon 1000uF 50 V Aluminium Electrolytic Capacitor, VY Series 1000h 12.5 Dia. x 25mm; HEIGHT: 26.5mm; MANUFACTURER_NAME: Nichicon; MANUFACTURER_PART_NUMBER: UVY1H102MHD; MOUSER_PART_NUMBER: 647-UVY1H102MHD; MOUSER_PRICE-STOCK: https://www.mouser.co.uk/ProductDetail/Nichicon/UVY1H102MHD/?qs=2y3HzBpM7VZovYRyLKWf6g%3D%3D
C33-C36 = SamacSys_Parts:PHE426HB7100JR06: Cap Film 1uF 250V PP 5% (18 X 9.5 X 17.5mm) Radial 15mm 105C Bulk Source: Datasheet <https://api.kemet.com/component-edge/download/datasheet/PHE426HB7100JR06.pdf>; ARROW_PART_NUMBER: PHE426HB7100JR06; ARROW_PRICE-STOCK: https://www.arrow.com/en/products/phe426hb7100jr06/kemet-corporation; DESCRIPTION: Cap Film 1uF 250V PP 5% (18 X 9.5 X 17.5mm) Radial 15mm 105C Bulk; HEIGHT: 17.5mm; MANUFACTURER_NAME: Kemet; MANUFACTURER_PART_NUMBER: PHE426HB7100JR06; MOUSER_PART_NUMBER: 80-PHE426HB7100JR06; MOUSER_PRICE-STOCK: https://www.mouser.co.uk/ProductDetail/KEMET/PHE426HB7100JR06/?qs=PoZJcSwa6Dz3JJy740eBfg%3D%3D
C65 C66 = SamacSys_Parts:B32652A3684J: Film Capacitors 0.68uF 250volts 5% Source: Datasheet <https://www.mouser.com/datasheet/2/400/MKP_B32651_658-1526470.pdf>; ARROW_PART_NUMBER: B32652A3684J; ARROW_PRICE-STOCK: https://www.arrow.com/en/products/b32652a3684j/epcos-tdk; DESCRIPTION: Film Capacitors 0.68uF 250volts 5%; HEIGHT: 17.5mm; MANUFACTURER_NAME: TDK; MANUFACTURER_PART_NUMBER: B32652A3684J; MOUSER_PART_NUMBER: 871-B32652A3684J; MOUSER_PRICE-STOCK: https://www.mouser.co.uk/ProductDetail/EPCOS-TDK/B32652A3684J/?qs=TAh7utZnAiV0johW6n%252ByyQ%3D%3D
CN1-CN3 = OSTYK33108030:OSTYK33102030-2
D1 = SamacSys_Parts:STPS0520Z: Schottky Diodes & Rectifiers 0.5 Amp 20 Volt Source: Datasheet <http://www.st.com/web/en/resource/technical/document/datasheet/CD00002261.pdf>; ARROW_PART_NUMBER: STPS0520Z; ARROW_PRICE-STOCK: https://www.arrow.com/en/products/stps0520z/stmicroelectronics; DESCRIPTION: Schottky Diodes & Rectifiers 0.5 Amp 20 Volt; HEIGHT: 1.45mm; MANUFACTURER_NAME: STMicroelectronics; MANUFACTURER_PART_NUMBER: STPS0520Z; MOUSER_PART_NUMBER: 511-STPS0520Z; MOUSER_PRICE-STOCK: https://www.mouser.co.uk/ProductDetail/STMicroelectronics/STPS0520Z/?qs=1tTY8DFIKACOdOblhuhK%252BA%3D%3D
IC1 = SamacSys_Parts:SPX1117M3-L-3-3_TR: LDO Regulator 3.3V 800mA 2.6-15V TO263-3 Source: Datasheet <https://componentsearchengine.com/Datasheets/2/SPX1117M3-L-3-3_TR.pdf>; ARROW_PART_NUMBER: SPX1117M3-L-3-3/TR; ARROW_PRICE-STOCK: https://www.arrow.com/en/products/spx1117m3-l-3-3tr/exar; DESCRIPTION: LDO Regulator 3.3V 800mA 2.6-15V TO263-3; HEIGHT: 1.8mm; MANUFACTURER_NAME: EXAR; MANUFACTURER_PART_NUMBER: SPX1117M3-L-3-3/TR; MOUSER_PART_NUMBER: 701-SPX1117M3-L-33TR; MOUSER_PRICE-STOCK: https://www.mouser.com/Search/Refine.aspx?Keyword=701-SPX1117M3-L-33TR
IC2 IC11 = SamacSys_Parts:L78M12ABDT-TR: L78M12ABDT-TR, Voltage Regulator, 0.5A 12 V, +/-2%, 3-Pin D-PAK Source: Datasheet <http://www.st.com/web/en/resource/technical/document/datasheet/CD00000447.pdf>; ARROW_PART_NUMBER: L78M12ABDT-TR; ARROW_PRICE-STOCK: https://www.arrow.com/en/products/l78m12abdt-tr/stmicroelectronics; DESCRIPTION: L78M12ABDT-TR, Voltage Regulator, 0.5A 12 V, +/-2%, 3-Pin D-PAK; HEIGHT: 2.4mm; MANUFACTURER_NAME: STMicroelectronics; MANUFACTURER_PART_NUMBER: L78M12ABDT-TR; MOUSER_PART_NUMBER: 511-L78M12ABDT-TR; MOUSER_PRICE-STOCK: https://www.mouser.co.uk/ProductDetail/STMicroelectronics/L78M12ABDT-TR/?qs=d4HGWzVBKqPjKUGRXugODg%3D%3D
IC3 = SamacSys_Parts:ESP32-WROVER-IE__16MB_: WiFi Modules (802.11) IPEX antenna Source: Datasheet <https://www.espressif.com/sites/default/files/documentation/esp32-wrover_datasheet_en.pdf>; DESCRIPTION: WiFi Modules (802.11) IPEX antenna; HEIGHT: 3.3mm; MANUFACTURER_NAME: Espressif Systems; MANUFACTURER_PART_NUMBER: ESP32-WROVER-IE (16MB); MOUSER_PART_NUMBER: 356-ESP32WRVIE2864UC; MOUSER_PRICE-STOCK: https://www.mouser.co.uk/ProductDetail/Espressif-Systems/ESP32-WROVER-IE-16MB?qs=GBLSl2AkirvM0syxAbzPDg%3D%3D
IC4 = SamacSys_Parts:TM8211: 16 2 SOP-8_150mil Digital To Analog Converters (DACs) RoHS Source: Datasheet <https://datasheet.lcsc.com/szlcsc/Shenzhen-Titan-Micro-Elec-TM8211_C92003.pdf>; DESCRIPTION: 16 2 SOP-8_150mil Digital To Analog Converters (DACs) RoHS; HEIGHT: 1.96mm; MANUFACTURER_NAME: TITAN MICRO ELECTRONICS; MANUFACTURER_PART_NUMBER: TM8211
IC5 IC8-IC10 = SamacSys_Parts:LM324D: LM324D, Quad Operational Amplifier 1.3MHz 5 to 28V, 14-Pin SO Source: Datasheet <http://www.st.com/st-web-ui/static/active/en/resource/technical/document/datasheet/CD00000457.pdf>; ARROW_PART_NUMBER: LM324D; ARROW_PRICE-STOCK: https://www.arrow.com/en/products/lm324d/stmicroelectronics; DESCRIPTION: LM324D, Quad Operational Amplifier 1.3MHz 5 to 28V, 14-Pin SO; HEIGHT: 1.75mm; MANUFACTURER_NAME: STMicroelectronics; MANUFACTURER_PART_NUMBER: LM324D; MOUSER_PART_NUMBER: 511-LM324D; MOUSER_PRICE-STOCK: https://www.mouser.co.uk/ProductDetail/STMicroelectronics/LM324D/?qs=eb%2FRSZx1fMu8HpwSZod0Vw%3D%3D
IC6 = SamacSys_Parts:TPA3244DDWR: 60W Stereo / 110W Peak PurePath Ultra-HD Analog-In, Pad-Down Class-D Amplifier Source: Datasheet <http://TI.com/tpa3244>; ARROW_PART_NUMBER: TPA3244DDWR; ARROW_PRICE-STOCK: https://www.arrow.com/en/products/tpa3244ddwr/texas-instruments; DESCRIPTION: 60W Stereo / 110W Peak PurePath Ultra-HD Analog-In, Pad-Down Class-D Amplifier; HEIGHT: 1.2mm; MANUFACTURER_NAME: Texas Instruments; MANUFACTURER_PART_NUMBER: TPA3244DDWR; MOUSER_PART_NUMBER: 595-TPA3244DDWR; MOUSER_PRICE-STOCK: https://www.mouser.co.uk/ProductDetail/Texas-Instruments/TPA3244DDWR/?qs=KuuZdrM3jLy0z3QDP7YLRA%3D%3D
IC7 = SamacSys_Parts:TPA3251D2DDVR: 175W Stereo / 350W Mono PurePath Ultra-HD, Analog-In Class-D Amplifier Source: Datasheet <http://www.ti.com/lit/gpn/tpa3251>; ARROW_PART_NUMBER: TPA3251D2DDVR; ARROW_PRICE-STOCK: https://www.arrow.com/en/products/tpa3251d2ddvr/texas-instruments; DESCRIPTION: 175W Stereo / 350W Mono PurePath Ultra-HD, Analog-In Class-D Amplifier; HEIGHT: 1.2mm; MANUFACTURER_NAME: Texas Instruments; MANUFACTURER_PART_NUMBER: TPA3251D2DDVR; MOUSER_PART_NUMBER: 595-TPA3251D2DDVR; MOUSER_PRICE-STOCK: https://www.mouser.co.uk/ProductDetail/Texas-Instruments/TPA3251D2DDVR/?qs=GJ%2F2ZGcr5uMcrBYa2JXNqg%3D%3D
J1 = SamacSys_Parts:0532610671: 1.25mm Pitch PicoBlade Header, Surface Mount, Right Angle, 6 Circuits Source: Datasheet <http://www.molex.com/webdocs/datasheets/pdf/en-us//0532610671_PCB_HEADERS.pdf>; ARROW_PART_NUMBER: 0532610671; ARROW_PRICE-STOCK: https://www.arrow.com/en/products/0532610671/molex; DESCRIPTION: 1.25mm Pitch PicoBlade Header, Surface Mount, Right Angle, 6 Circuits; HEIGHT: mm; MANUFACTURER_NAME: Molex; MANUFACTURER_PART_NUMBER: 0532610671
J2 = jack_04:JW-PJ-307-4
J4 = B4P-VH_LF__SN_:B4P-VH_LF__SN_: connector,multipole PCB use,B4P-VH,VH se JST VH Series, 3.96mm Pitch 4 Way 1 Row Straight PCB Header, Solder Termination, 10A Source: Datasheet <http://docs-emea.rs-online.com/webdocs/1347/0900766b81347516.pdf>; ARROW_PART_NUMBER: B4P-VH(LF)(SN); ARROW_PRICE-STOCK: https://www.arrow.com/en/products/b4p-vh-lf-sn/jst-manufacturing; DESCRIPTION: connector,multipole PCB use,B4P-VH,VH se JST VH Series, 3.96mm Pitch 4 Way 1 Row Straight PCB Header, Solder Termination, 10A; HEIGHT: 9.4mm; MANUFACTURER_NAME: JST (JAPAN SOLDERLESS TERMINALS); MANUFACTURER_PART_NUMBER: B4P-VH(LF)(SN)
JP1 = pinhead:PINHD-1X2: PIN HEADER
L1-L4 = SamacSys_Parts:48100SC: Murata Shielded Wire-wound SMD Inductor 10 uH +/-20% 4.5A Idc Q:32 Source: Datasheet <https://www.mouser.co.uk/datasheet/2/281/kmp_4800s-46629.pdf>; ARROW_PART_NUMBER: 48100SC; ARROW_PRICE-STOCK: https://www.arrow.com/en/products/48100sc/murata-power-solutions; DESCRIPTION: Murata Shielded Wire-wound SMD Inductor 10 uH +/-20% 4.5A Idc Q:32; HEIGHT: 6mm; MANUFACTURER_NAME: Murata Electronics; MANUFACTURER_PART_NUMBER: 48100SC; MOUSER_PART_NUMBER: 580-48100SC; MOUSER_PRICE-STOCK: https://www.mouser.co.uk/ProductDetail/Murata-Power-Solutions/48100SC/?qs=ocmcTMnGEDiRVh3BIgymNQ%3D%3D
L5-L8 = SamacSys_Parts:74477010: SMD-Shielded Power Inductors WE-PD Source: Datasheet; DESCRIPTION: SMD-Shielded Power Inductors WE-PD; HEIGHT: mm; MANUFACTURER_NAME: Wurth Elektronik; MANUFACTURER_PART_NUMBER: 74477010; MOUSER_PART_NUMBER: 710-74477010; MOUSER_PRICE-STOCK: https://www.mouser.co.uk/ProductDetail/Wurth-Elektronik/74477010/?qs=E%2F%2FhvbtCqpN9eEwYoxClfg%3D%3D
Q1 = SamacSys_Parts:RK7002BMT116: 2.5V Drive Nch MOSFET: MOSFETs are made as ultra-low ON-resistance by the micro-processing technologies suitable for mobilr equipment for low current consumption. In wide lineup including compact type, high-power type and complex type to meet in the market. Source: Datasheet <https://www.rohm.com/datasheet/RK7002BM/rk7002bmt116-e>; DESCRIPTION: 2.5V Drive Nch MOSFET: MOSFETs are made as ultra-low ON-resistance by the micro-processing technologies suitable for mobilr equipment for low current consumption. In wide lineup including compact type, high-power type and complex type to meet in the market.; HEIGHT: 1.2mm; MANUFACTURER_NAME: ROHM Semiconductor; MANUFACTURER_PART_NUMBER: RK7002BMT116; MOUSER_PART_NUMBER: 755-RK7002BMT116; MOUSER_PRICE-STOCK: https://www.mouser.co.uk/ProductDetail/ROHM-Semiconductor/RK7002BMT116?qs=npTsUczJOtO4aXz%2Fx%2FNVUw%3D%3D
R1-R45 R47-R55 = rcl:R-EU_: RESISTOR, European symbol; SPICEPREFIX: R
R46 = Pot-PDB18:PDB182-K430K-503A; BUILT_BY: EMA_Cory; COPYRIGHT: Copyright (C) 2018 Accelerated Designs. All rights reserved; DATASHEET: https://www.bourns.com/docs/Product-Datasheets/PDB18.pdf; MANUFACTURER_PART_NUMBER: PDB182-K420K-103A2; SOURCELIBRARY: Bourns_Electronics_2020-05-06; VENDOR: Bourns Electronics
SJ1 SJ2 = jumper:SJ: SMD solder JUMPER
SW3 = PDB181-K420F-103A2:PDB181-K420F-103A2; BUILT_BY: EMA_Matt; COPYRIGHT: Copyright (C) 2018 Accelerated Designs. All rights reserved; DATASHEET: https://www.datasheet.live/index.php?title=Special:PdfViewer&url=https%3A%2F%2Fpdf.datasheet.live%2F2b00c922%2Fbourns.com%2FPDB181-K420F-103A2.pdf; MANUFACTURER_PART_NUMBER: PDB181-K420F-103A2; SOURCELIBRARY: Add_to_database_2020-12-03; VENDOR: Bourns Electronics
TP1-TP11 = testpad:TP: Test pad
U$1 U$2 = V5618C:V5618C
U$3 U$4 = V5618A:V5618A